# Altium schematic sheet InterfMCU.SchDoc
size 420 x 297 mm; Address1: Address1; Address2: Address2; Address3: Address3; Address4: Address4; SheetNumber: 4; SheetTotal: 4; Scale: 1:1; DocumentType: Схема электрическая принципиальная
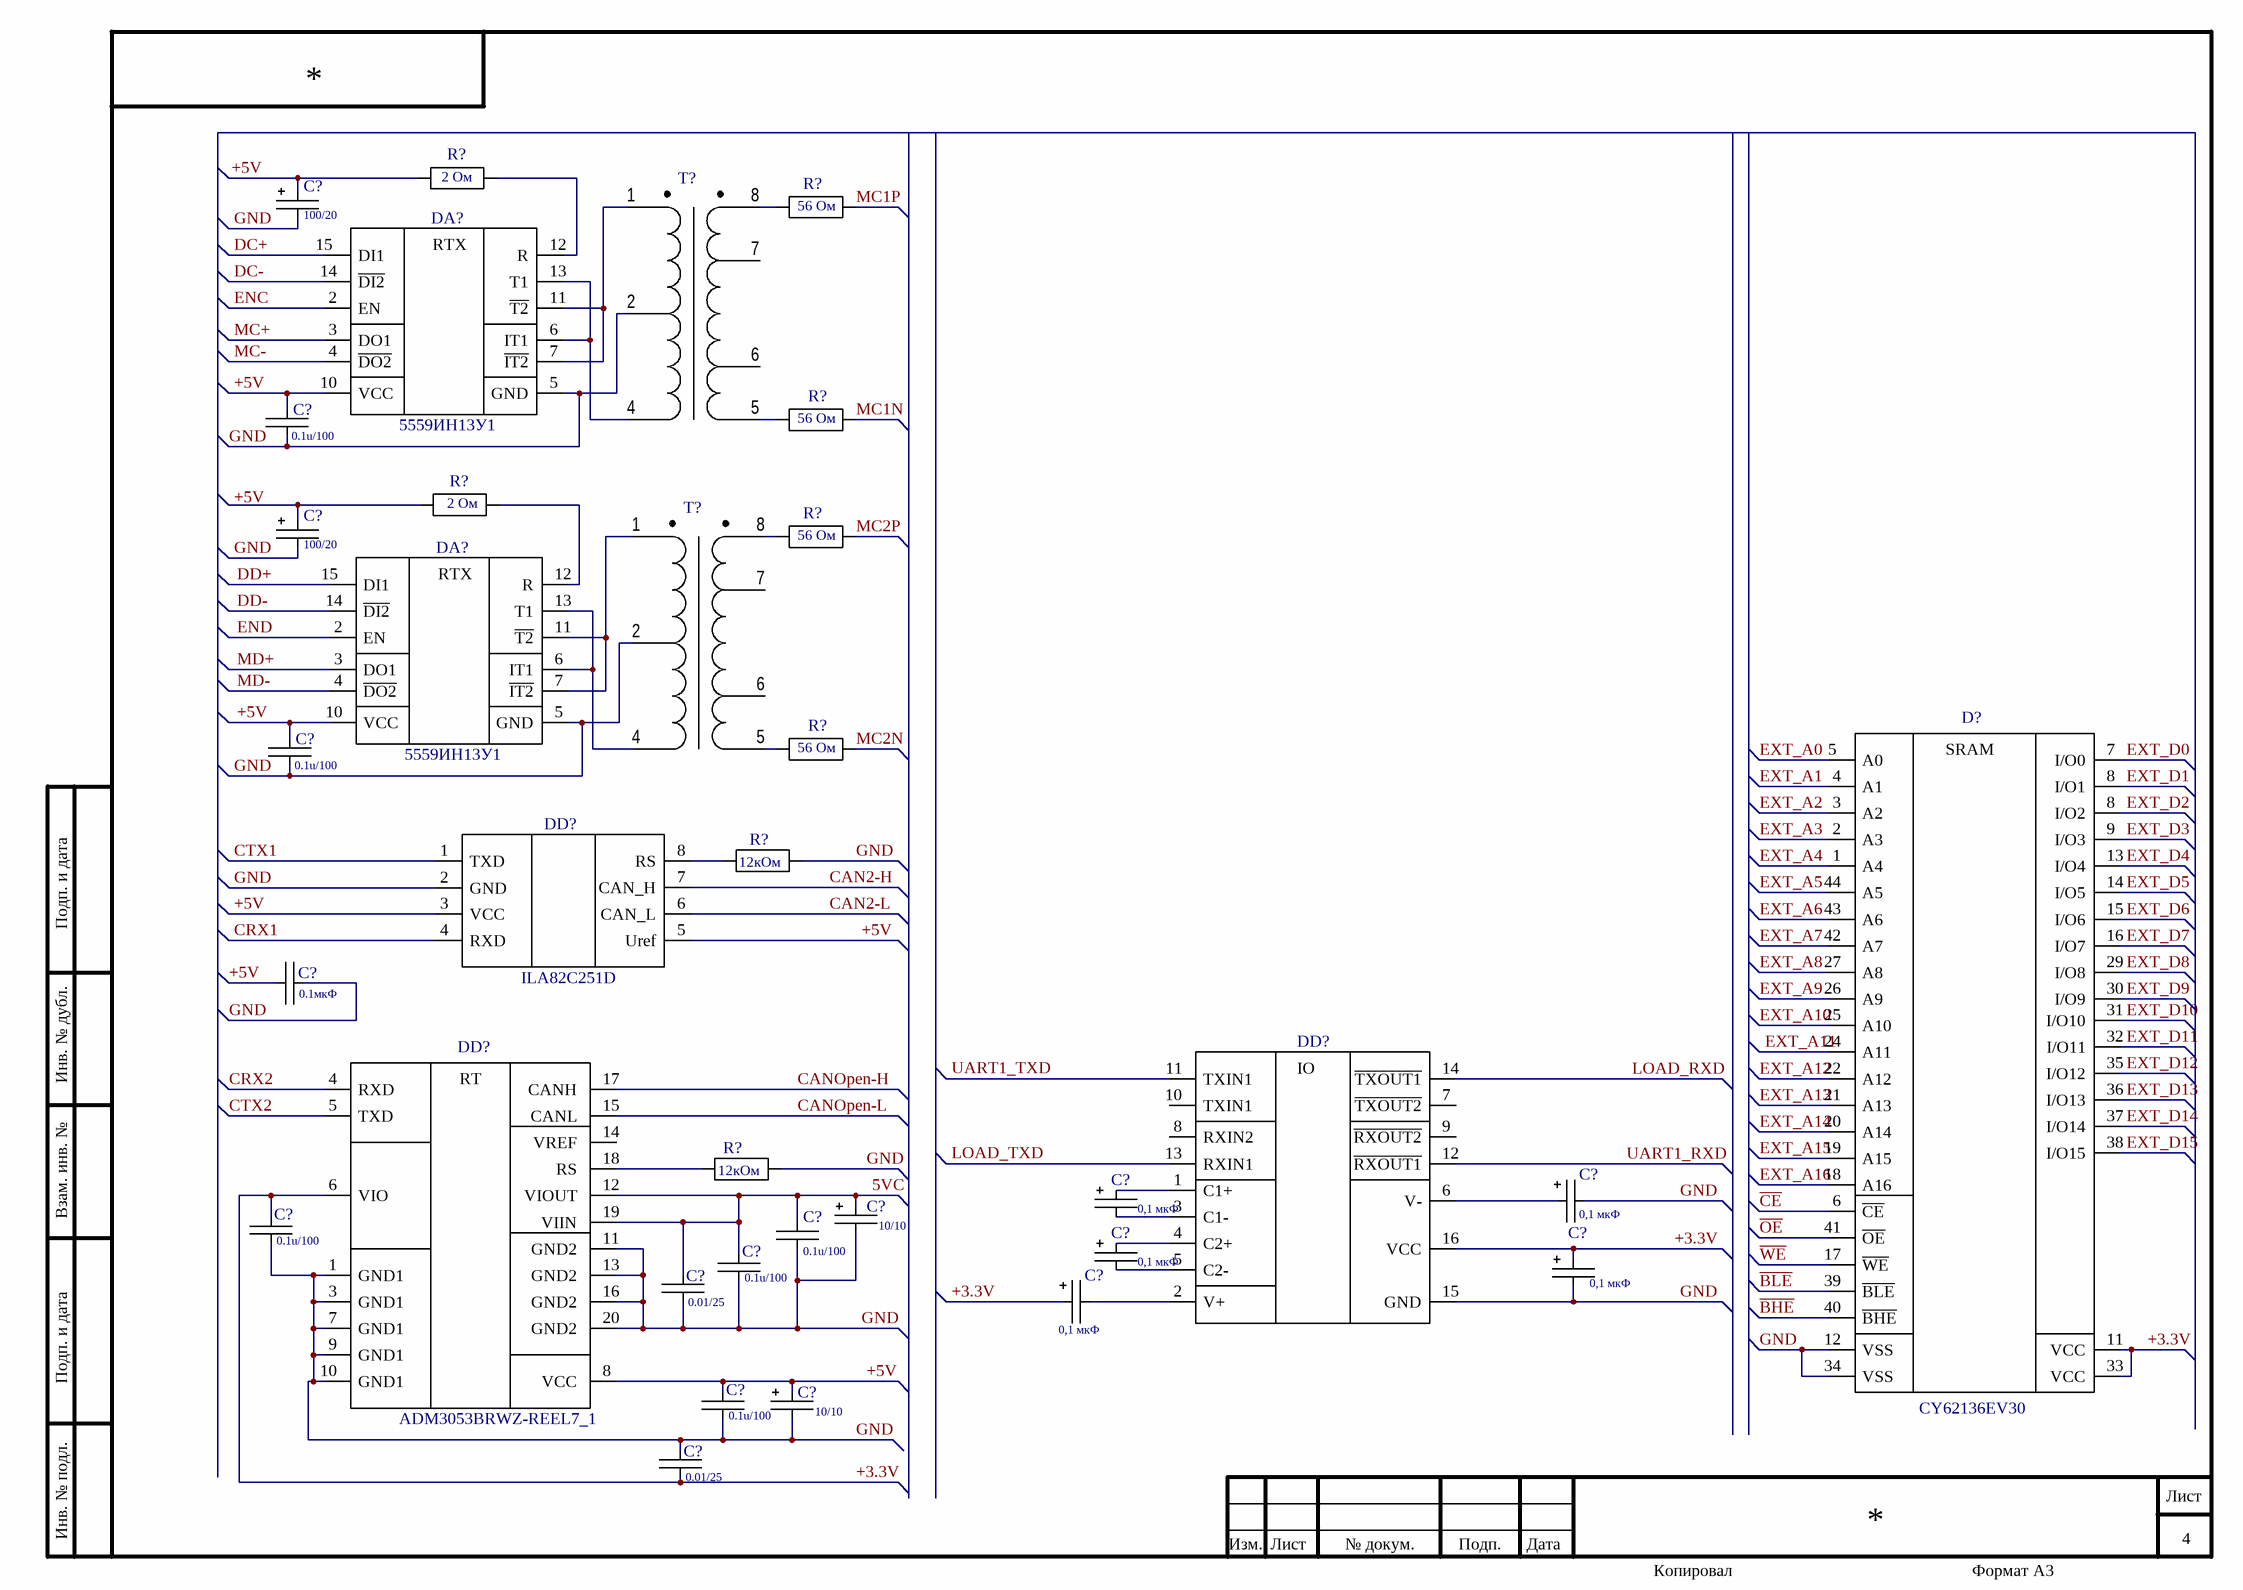
[diagram p0: InterfMCU.SchDoc]

## Parts
(Parts that share a designator on the sheet are numbered #1, #2 ... from top to bottom, then left to right.)
C?#1  100/20
C?#2  0.1u/100
C?#3  100/20
C?#4  0.1u/100
C?#5  0.1мкФ
C?#6  0,1 мкФ
C?#7  0,1 мкФ
C?#8  10/10
C?#9  0.1u/100
C?#10  0.1u/100
C?#11  0,1 мкФ
C?#12  0.1u/100
C?#13  0,1 мкФ
C?#14  0.01/25
C?#15  0,1 мкФ
C?#16  0.1u/100
C?#17  10/10
C?#18  0.01/25
D?  CY62136EV30
DA?#1  5559ИН13У1
DA?#2  5559ИН13У1
DD?#1  ILA82C251D
DD?#2  ILX3232  (value not drawn)
DD?#3  ADM3053BRWZ-REEL7_1
R?#1  2 Ом
R?#2  56 Ом
R?#3  56 Ом
R?#4  2 Ом
R?#5  56 Ом
R?#6  56 Ом
R?#7  12кОм
R?#8  12кОм
Т?#1  (no value)
Т?#2  (no value)

## Nets
5VC: C?#8.1 C?#10.1 C?#12.1 C?#14.1 DD?#3.12(VIOUT) DD?#3.19(VIIN)
+3.3V: C?#9.1 C?#13.1 C?#15.1 C?#18.2 D?.11(VCC) D?.33(VCC) DD?#2.16(VCC) DD?#3.6(VIO)
+5V: C?#1.1 C?#2.1 C?#4.1 C?#5.1 C?#16.1 C?#17.1 DA?#1.10(VCC) DA?#2.10(VCC) DD?#1.3(VCC) DD?#1.5(Uref) DD?#3.8(VCC) R?#1.1
~{BHE}: D?.40(~{BHE})
~{BLE}: D?.39(~{BLE})
~{CE}: D?.6(~{CE})
~{OE}: D?.41(~{OE})
~{WE}: D?.17(~{WE})
CAN2-H: DD?#1.7(CAN_H)
CAN2-L: DD?#1.6(CAN_L)
CANOpen-H: DD?#3.17(CANH)
CANOpen-L: DD?#3.15(CANL)
CRX1: DD?#1.4(RXD)
CRX2: DD?#3.4(RXD)
CTX1: DD?#1.1(TXD)
CTX2: DD?#3.5(TXD)
DC+: DA?#1.15(DI1)
DC-: DA?#1.14(~{DI2})
DD+: DA?#2.15(DI1)
DD-: DA?#2.14(~{DI2})
ENC: DA?#1.2(EN)
END: DA?#2.2(EN)
EXT_A0: D?.5(A0)
EXT_A1: D?.4(A1)
EXT_A2: D?.3(A2)
EXT_A3: D?.2(A3)
EXT_A4: D?.1(A4)
EXT_A5: D?.44(A5)
EXT_A6: D?.43(A6)
EXT_A7: D?.42(A7)
EXT_A8: D?.27(A8)
EXT_A9: D?.26(A9)
EXT_A10: D?.25(A10)
EXT_A11: D?.24(A11)
EXT_A12: D?.22(A12)
EXT_A13: D?.21(A13)
EXT_A14: D?.20(A14)
EXT_A15: D?.19(A15)
EXT_A16: D?.18(A16)
EXT_D0: D?.7(I/O0)
EXT_D1: D?.8(I/O1)
EXT_D2: D?.8(I/O2)
EXT_D3: D?.9(I/O3)
EXT_D4: D?.13(I/O4)
EXT_D5: D?.14(I/O5)
EXT_D6: D?.15(I/O6)
EXT_D7: D?.16(I/O7)
EXT_D8: D?.29(I/O8)
EXT_D9: D?.30(I/O9)
EXT_D10: D?.31(I/O10)
EXT_D11: D?.32(I/O11)
EXT_D12: D?.35(I/O12)
EXT_D13: D?.36(I/O13)
EXT_D14: D?.37(I/O14)
EXT_D15: D?.38(I/O15)
GND: C?#1.2 C?#2.2 C?#3.2 C?#4.2 C?#5.2 C?#7.2 C?#8.2 C?#9.2 C?#10.2 C?#12.2 C?#13.2 C?#14.2 C?#16.2 C?#17.2 C?#18.1 D?.12(VSS) D?.34(VSS) DA?#1.5(GND) DA?#2.5(GND) DD?#1.2(GND) DD?#2.15(GND) DD?#3.1(GND1) DD?#3.3(GND1) DD?#3.7(GND1) DD?#3.9(GND1) DD?#3.10(GND1) DD?#3.11(GND2) DD?#3.13(GND2) DD?#3.16(GND2) DD?#3.20(GND2) R?#7.2 R?#8.2 Т?#1.2 Т?#2.2
LOAD_RXD: DD?#2.14(~{TXOUT1})
LOAD_TXD: DD?#2.13(RXIN1)
MC1N: R?#3.2
MC1P: R?#2.2
MC2N: R?#6.2
MC2P: R?#5.2
MC+: DA?#1.3(DO1)
MC-: DA?#1.4(~{DO2})
MD+: DA?#2.3(DO1)
MD-: DA?#2.4(~{DO2})
UART1_RXD: DD?#2.12(~{RXOUT1})
UART1_TXD: DD?#2.11(TXIN1)
NetC?#3_1: C?#3.1 R?#4.1
NetC?#6_1: C?#6.1 DD?#2.1(С1+)
NetC?#6_2: C?#6.2 DD?#2.3(С1-)
NetC?#7_1: C?#7.1 DD?#2.6(V-)
NetC?#11_1: C?#11.1 DD?#2.4(C2+)
NetC?#11_2: C?#11.2 DD?#2.5(C2-)
NetC?#15_2: C?#15.2 DD?#2.2(V+)
NetDA?#1_6: DA?#1.6(IT1) DA?#1.13(T1) Т?#1.4
NetDA?#1_7: DA?#1.7(~{IT2}) DA?#1.11(~{T2}) Т?#1.1
NetDA?#1_12: DA?#1.12(R) R?#1.2
NetDA?#2_6: DA?#2.6(IT1) DA?#2.13(T1) Т?#2.4
NetDA?#2_7: DA?#2.7(~{IT2}) DA?#2.11(~{T2}) Т?#2.1
NetDA?#2_12: DA?#2.12(R) R?#4.2
NetDD?#1_8: DD?#1.8(RS) R?#7.1
NetDD?#3_18: DD?#3.18(RS) R?#8.1
NetR?#2_1: R?#2.1 Т?#1.8
NetR?#3_1: R?#3.1 Т?#1.5
NetR?#5_1: R?#5.1 Т?#2.8
NetR?#6_1: R?#6.1 Т?#2.5

Not connected (* = marked no-connect by the designer): DD?#2 7(~{TXOUT2}) 8(RXIN2) 9(~{RXOUT2}) 10(TXIN1); DD?#3 14(VREF_); Т?#1 6 7; Т?#2 6 7

## Notes on the sheet
- Подп. и дата
- Инв. № дубл.
- Взам. инв. №
- Инв. № подл.
- Изм.
- Лист
- № докум.
- Подп.
- Дата
- Копировал
- Формат А3
- Labels drawn without touching a wire or pin: +5V
- (in symbol 5559ИН13У1) RTX
- (in symbol ADM3053BRWZ-REEL7_1) RT
- (in symbol CY62136EV30) SRAM
- (in symbol ILX3232) IO

## Library data of the parts
C?#1 C?#3 C?#7 = К53-68E: Конденсатор полярный
C?#2 C?#4 C?#5 C?#14 C?#18 = К10-69: Керамический чип-конденсатор серии К10-79; PartNumber: К10-69в-*-* В- * ± *% *; TypePrefix: C; TU: АЖЯР.673511.002ТУ; TUHolder: ОАО НИИ "ГИРИКОНД"; Value: *; PackegeType: *
C?#6 C?#8 C?#11 C?#13 C?#15 C?#17 = К53-68B: Конденсатор / полярный
C?#9 C?#10 C?#12 C?#16 = К10-69в-3225: Конденсатор неполярный
D? = CY62136EV30: СОЗУ CY62136EV30 256КБ
DA?#1 DA?#2 = 5559ИН13У1: МКИО приемопередатчик 5559ИН13Т
DD?#1 = ILA82C251D: CAN Приемопередатчик  ILA82C251D
DD?#2 = ILX3232: RS-232 Приемопередатчик ILX3232
DD?#3 = ADM3053BRWZ-REEL7_1: Микросборка CAN с гальванической развязкой
R?#1-R?#6 = Р1-12-0,5: Резистор постоянный
R?#7 R?#8 = Р1-12-0,125: Резистор постоянный
Т?#1 Т?#2 = ТИЛ6В: Трансформатор для ГОСТ Р 52070-2003